# Altium schematic sheet Sheet2.SchDoc
size A3; SheetNumber: 2; SheetTotal: 2
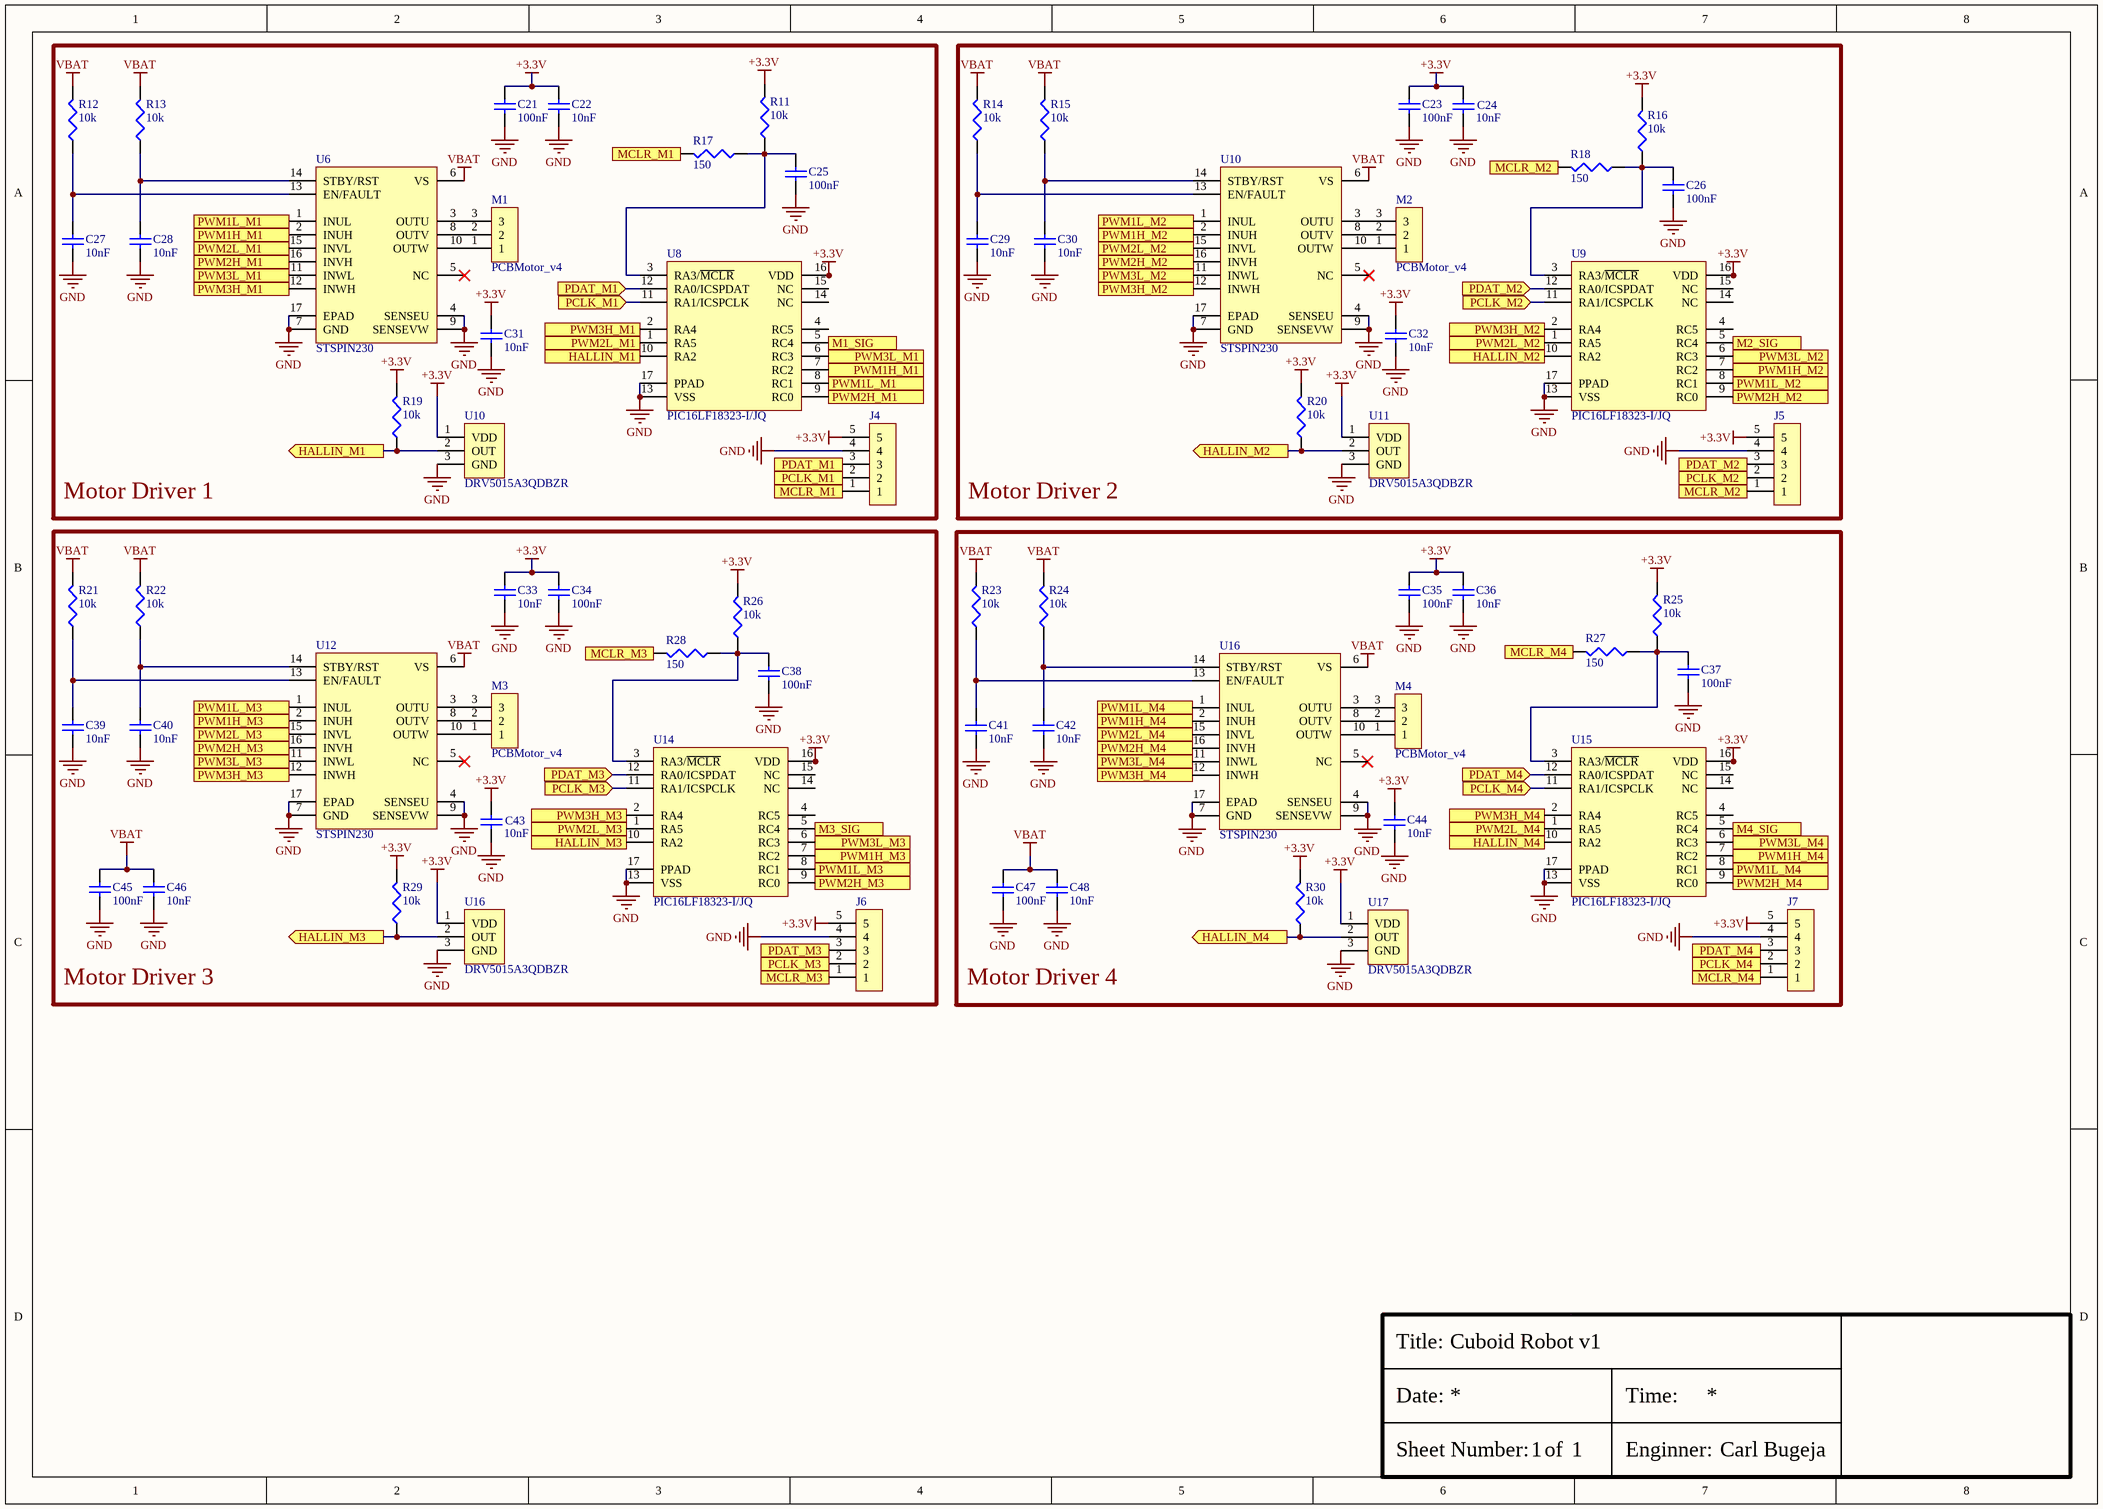
[diagram p0: Sheet2.SchDoc]

## Parts
(Parts that share a designator on the sheet are numbered #1, #2 ... from top to bottom, then left to right.)
C21  100nF  [RESC1005X03N]
C22  10nF  [RESC1005X03N]
C23  100nF  [RESC1005X03N]
C24  10nF  [RESC1005X03N]
C25  100nF  [RESC1005X03N]
C26  100nF  [RESC1005X03N]
C27  10nF  [RESC1005X03N]
C28  10nF  [RESC1005X03N]
C29  10nF  [RESC1005X03N]
C30  10nF  [RESC1005X03N]
C31  10nF  [RESC1005X03N]
C32  10nF  [RESC1005X03N]
C33  10nF  [RESC1005X03N]
C34  100nF  [RESC1005X03N]
C35  100nF  [RESC1005X03N]
C36  10nF  [RESC1005X03N]
C37  100nF  [RESC1005X03N]
C38  100nF  [RESC1005X03N]
C39  10nF  [RESC1005X03N]
C40  10nF  [RESC1005X03N]
C41  10nF  [RESC1005X03N]
C42  10nF  [RESC1005X03N]
C43  10nF  [RESC1005X03N]
C44  10nF  [RESC1005X03N]
C45  100nF  [RESC1005X03N]
C46  10nF  [RESC1005X03N]
C47  100nF  [RESC1005X03N]
C48  10nF  [RESC1005X03N]
J4  H5P1.27  [H5P1.27P]  (value not drawn)
J5  H5P1.27  [H5P1.27P]  (value not drawn)
J6  H5P1.27  [H5P1.27P]  (value not drawn)
J7  H5P1.27  [H5P1.27P]  (value not drawn)
M1  PCBMotor_v4  [PCBMotor_v4]
M2  PCBMotor_v4  [PCBMotor_v4]
M3  PCBMotor_v4  [PCBMotor_v4]
M4  PCBMotor_v4  [PCBMotor_v4]
R11  10k  [RESC1005X03N]
R12  10k  [RESC1005X03N]
R13  10k  [RESC1005X03N]
R14  10k  [RESC1005X03N]
R15  10k  [RESC1005X03N]
R16  10k  [RESC1005X03N]
R17  150  [RESC1005X03N]
R18  150  [RESC1005X03N]
R19  10k  [RESC1005X03N]
R20  10k  [RESC1005X03N]
R21  10k  [RESC1005X03N]
R22  10k  [RESC1005X03N]
R23  10k  [RESC1005X03N]
R24  10k  [RESC1005X03N]
R25  10k  [RESC1005X03N]
R26  10k  [RESC1005X03N]
R27  150  [RESC1005X03N]
R28  150  [RESC1005X03N]
R29  10k  [RESC1005X03N]
R30  10k  [RESC1005X03N]
U6  STSPIN230  [QFN50P300X300X100_HS-17N]
U8  PIC16LF18323-I/JQ  [PIC16F18323-I/JQ]
U9  PIC16LF18323-I/JQ  [PIC16F18323-I/JQ]
U10#1  STSPIN230  [QFN50P300X300X100_HS-17N]
U10#2  DRV5015A3QDBZR  [SOT95P237X95-3N]
U11  DRV5015A3QDBZR  [SOT95P237X95-3N]
U12  STSPIN230  [QFN50P300X300X100_HS-17N]
U14  PIC16LF18323-I/JQ  [PIC16F18323-I/JQ]
U15  PIC16LF18323-I/JQ  [PIC16F18323-I/JQ]
U16#1  STSPIN230  [QFN50P300X300X100_HS-17N]
U16#2  DRV5015A3QDBZR  [SOT95P237X95-3N]
U17  DRV5015A3QDBZR  [SOT95P237X95-3N]

## Blocks framed on the sheet
Motor Driver 1: C21 C22 C25 C27 C28 C31 J4 M1 R11-R13 R17 R19 U6 U8 U10#2
Motor Driver 2: C23 C24 C26 C29 C30 C32 J5 M2 R14-R16 R18 R20 U9 U10#1 U11
Motor Driver 3: C33 C34 C38-C40 C43 C45 C46 J6 M3 R21 R22 R26 R28 R29 U12 U14 U16#2
Motor Driver 4: C35-C37 C41 C42 C44 C47 C48 J7 M4 R23-R25 R27 R30 U15 U16#1 U17

## Ports
HALLIN_M1 (in), HALLIN_M1 (out), HALLIN_M2 (in), HALLIN_M2 (out), HALLIN_M3 (in), HALLIN_M3 (out), HALLIN_M4 (in), HALLIN_M4 (out), M1_SIG (in), M2_SIG (in), M3_SIG (in), M4_SIG (in), MCLR_M1 (in), MCLR_M1 (out), MCLR_M2 (in), MCLR_M2 (out), MCLR_M3 (in), MCLR_M3 (out), MCLR_M4 (in), MCLR_M4 (out), PCLK_M1 (in), PCLK_M2 (in), PCLK_M3 (in), PCLK_M4 (in), PDAT_M1 (in), PDAT_M2 (in), PDAT_M3 (in), PDAT_M4 (in), PWM1H_M1 (in), PWM1H_M1 (out), PWM1H_M2 (in), PWM1H_M2 (out), PWM1H_M3 (in), PWM1H_M3 (out), PWM1H_M4 (in), PWM1H_M4 (out), PWM1L_M1 (in), PWM1L_M1 (out), PWM1L_M2 (in), PWM1L_M2 (out), PWM1L_M3 (in), PWM1L_M3 (out), PWM1L_M4 (in), PWM1L_M4 (out), PWM2H_M1 (in), PWM2H_M1 (out), PWM2H_M2 (in), PWM2H_M2 (out), PWM2H_M3 (in), PWM2H_M3 (out), PWM2H_M4 (in), PWM2H_M4 (out), PWM2L_M1 (in), PWM2L_M1 (out), PWM2L_M2 (in), PWM2L_M2 (out), PWM2L_M3 (in), PWM2L_M3 (out), PWM2L_M4 (in), PWM2L_M4 (out), PWM3H_M1 (in), PWM3H_M1 (out), PWM3H_M2 (in), PWM3H_M2 (out), PWM3H_M3 (in), PWM3H_M3 (out), PWM3H_M4 (in), PWM3H_M4 (out), PWM3L_M1 (in), PWM3L_M1 (out), PWM3L_M2 (in), PWM3L_M2 (out), PWM3L_M3 (in), PWM3L_M3 (out), PWM3L_M4 (in), PWM3L_M4 (out)

## Nets
+3.3V: C21.1 C22.1 C23.1 C24.1 C31.1 C32.1 C33.1 C34.1 C35.1 C36.1 C43.1 C44.1 J4.5 J5.5 J6.5 J7.5 R11.2 R16.2 R19.2 R20.2 R25.2 R26.2 R29.2 R30.2 U8.16(VDD) U9.16(VDD) U10#2.1(VDD) U11.1(VDD) U14.16(VDD) U15.16(VDD) U16#2.1(VDD) U17.1(VDD)
GND: C21.2 C22.2 C23.2 C24.2 C25.2 C26.2 C27.2 C28.2 C29.2 C30.2 C31.2 C32.2 C33.2 C34.2 C35.2 C36.2 C37.2 C38.2 C39.2 C40.2 C41.2 C42.2 C43.2 C44.2 C45.2 C46.2 C47.2 C48.2 J4.4 J5.4 J6.4 J7.4 U6.4(SENSEU) U6.7(GND) U6.9(SENSEVW) U6.17(EPAD) U8.13(VSS) U8.17(PPAD) U9.13(VSS) U9.17(PPAD) U10#1.4(SENSEU) U10#1.7(GND) U10#1.9(SENSEVW) U10#1.17(EPAD) U10#2.3(GND) U11.3(GND) U12.4(SENSEU) U12.7(GND) U12.9(SENSEVW) U12.17(EPAD) U14.13(VSS) U14.17(PPAD) U15.13(VSS) U15.17(PPAD) U16#1.4(SENSEU) U16#1.7(GND) U16#1.9(SENSEVW) U16#1.17(EPAD) U16#2.3(GND) U17.3(GND)
VBAT: C45.1 C46.1 C47.1 C48.1 R12.2 R13.2 R14.2 R15.2 R21.2 R22.2 R23.2 R24.2 U6.6(VS) U10#1.6(VS) U12.6(VS) U16#1.6(VS)
HALLIN_M1: R19.1 U8.10(RA2) U10#2.2(OUT) ; port HALLIN_M1
HALLIN_M2: R20.1 U9.10(RA2) U11.2(OUT) ; port HALLIN_M2
HALLIN_M3: R29.1 U14.10(RA2) U16#2.2(OUT) ; port HALLIN_M3
HALLIN_M4: R30.1 U15.10(RA2) U17.2(OUT) ; port HALLIN_M4
M1_SIG: U8.5(RC4) ; port M1_SIG
M2_SIG: U9.5(RC4) ; port M2_SIG
M3_SIG: U14.5(RC4) ; port M3_SIG
M4_SIG: U15.5(RC4) ; port M4_SIG
MCLR_M1: J4.1 R17.2 ; port MCLR_M1
MCLR_M2: J5.1 R18.2 ; port MCLR_M2
MCLR_M3: J6.1 R28.2 ; port MCLR_M3
MCLR_M4: J7.1 R27.2 ; port MCLR_M4
PCLK_M1: J4.2 U8.11(RA1/ICSPCLK) ; port PCLK_M1
PCLK_M2: J5.2 U9.11(RA1/ICSPCLK) ; port PCLK_M2
PCLK_M3: J6.2 U14.11(RA1/ICSPCLK) ; port PCLK_M3
PCLK_M4: J7.2 U15.11(RA1/ICSPCLK) ; port PCLK_M4
PDAT_M1: J4.3 U8.12(RA0/ICSPDAT) ; port PDAT_M1
PDAT_M2: J5.3 U9.12(RA0/ICSPDAT) ; port PDAT_M2
PDAT_M3: J6.3 U14.12(RA0/ICSPDAT) ; port PDAT_M3
PDAT_M4: J7.3 U15.12(RA0/ICSPDAT) ; port PDAT_M4
PWM1H_M1: U6.2(INUH) U8.7(RC2) ; port PWM1H_M1
PWM1H_M2: U9.7(RC2) U10#1.2(INUH) ; port PWM1H_M2
PWM1H_M3: U12.2(INUH) U14.7(RC2) ; port PWM1H_M3
PWM1H_M4: U15.7(RC2) U16#1.2(INUH) ; port PWM1H_M4
PWM1L_M1: U6.1(INUL) U8.8(RC1) ; port PWM1L_M1
PWM1L_M2: U9.8(RC1) U10#1.1(INUL) ; port PWM1L_M2
PWM1L_M3: U12.1(INUL) U14.8(RC1) ; port PWM1L_M3
PWM1L_M4: U15.8(RC1) U16#1.1(INUL) ; port PWM1L_M4
PWM2H_M1: U6.16(INVH) U8.9(RC0) ; port PWM2H_M1
PWM2H_M2: U9.9(RC0) U10#1.16(INVH) ; port PWM2H_M2
PWM2H_M3: U12.16(INVH) U14.9(RC0) ; port PWM2H_M3
PWM2H_M4: U15.9(RC0) U16#1.16(INVH) ; port PWM2H_M4
PWM2L_M1: U6.15(INVL) U8.1(RA5) ; port PWM2L_M1
PWM2L_M2: U9.1(RA5) U10#1.15(INVL) ; port PWM2L_M2
PWM2L_M3: U12.15(INVL) U14.1(RA5) ; port PWM2L_M3
PWM2L_M4: U15.1(RA5) U16#1.15(INVL) ; port PWM2L_M4
PWM3H_M1: U6.12(INWH) U8.2(RA4) ; port PWM3H_M1
PWM3H_M2: U9.2(RA4) U10#1.12(INWH) ; port PWM3H_M2
PWM3H_M3: U12.12(INWH) U14.2(RA4) ; port PWM3H_M3
PWM3H_M4: U15.2(RA4) U16#1.12(INWH) ; port PWM3H_M4
PWM3L_M1: U6.11(INWL) U8.6(RC3) ; port PWM3L_M1
PWM3L_M2: U9.6(RC3) U10#1.11(INWL) ; port PWM3L_M2
PWM3L_M3: U12.11(INWL) U14.6(RC3) ; port PWM3L_M3
PWM3L_M4: U15.6(RC3) U16#1.11(INWL) ; port PWM3L_M4
NetC25_1: C25.1 R11.1 R17.1 U8.3(RA3/~{MCLR})
NetC26_1: C26.1 R16.1 R18.1 U9.3(RA3/~{MCLR})
NetC27_1: C27.1 R12.1 U6.13(EN/FAULT)
NetC28_1: C28.1 R13.1 U6.14(STBY/RST)
NetC29_1: C29.1 R14.1 U10#1.13(EN/FAULT)
NetC30_1: C30.1 R15.1 U10#1.14(STBY/RST)
NetC37_1: C37.1 R25.1 R27.1 U15.3(RA3/~{MCLR})
NetC38_1: C38.1 R26.1 R28.1 U14.3(RA3/~{MCLR})
NetC39_1: C39.1 R21.1 U12.13(EN/FAULT)
NetC40_1: C40.1 R22.1 U12.14(STBY/RST)
NetC41_1: C41.1 R23.1 U16#1.13(EN/FAULT)
NetC42_1: C42.1 R24.1 U16#1.14(STBY/RST)
NetM1_1: M1.1 U6.10(OUTW)
NetM1_2: M1.2 U6.8(OUTV)
NetM1_3: M1.3 U6.3(OUTU)
NetM2_1: M2.1 U10#1.10(OUTW)
NetM2_2: M2.2 U10#1.8(OUTV)
NetM2_3: M2.3 U10#1.3(OUTU)
NetM3_1: M3.1 U12.10(OUTW)
NetM3_2: M3.2 U12.8(OUTV)
NetM3_3: M3.3 U12.3(OUTU)
NetM4_1: M4.1 U16#1.10(OUTW)
NetM4_2: M4.2 U16#1.8(OUTV)
NetM4_3: M4.3 U16#1.3(OUTU)

Not connected (* = marked no-connect by the designer): U6 5(NC)*; U8 4(RC5) 14(NC) 15(NC); U9 4(RC5) 14(NC) 15(NC); U10#1 5(NC)*; U12 5(NC)*; U14 4(RC5) 14(NC) 15(NC); U15 4(RC5) 14(NC) 15(NC); U16#1 5(NC)*

## Notes on the sheet
- Title:
- Cuboid Robot v1
- Date:
- Sheet Number:
- 1
- of
- Enginner:
- Time:
- Carl Bugeja

## Library data of the parts
C21-C48 = CAP
R11-R30 = RES
U8 U9 U14 U15 = PIC16F18323-I/JQ